# EAGLE design DeMux (EAGLE 6.6.0)

## Sheet 1 of 2
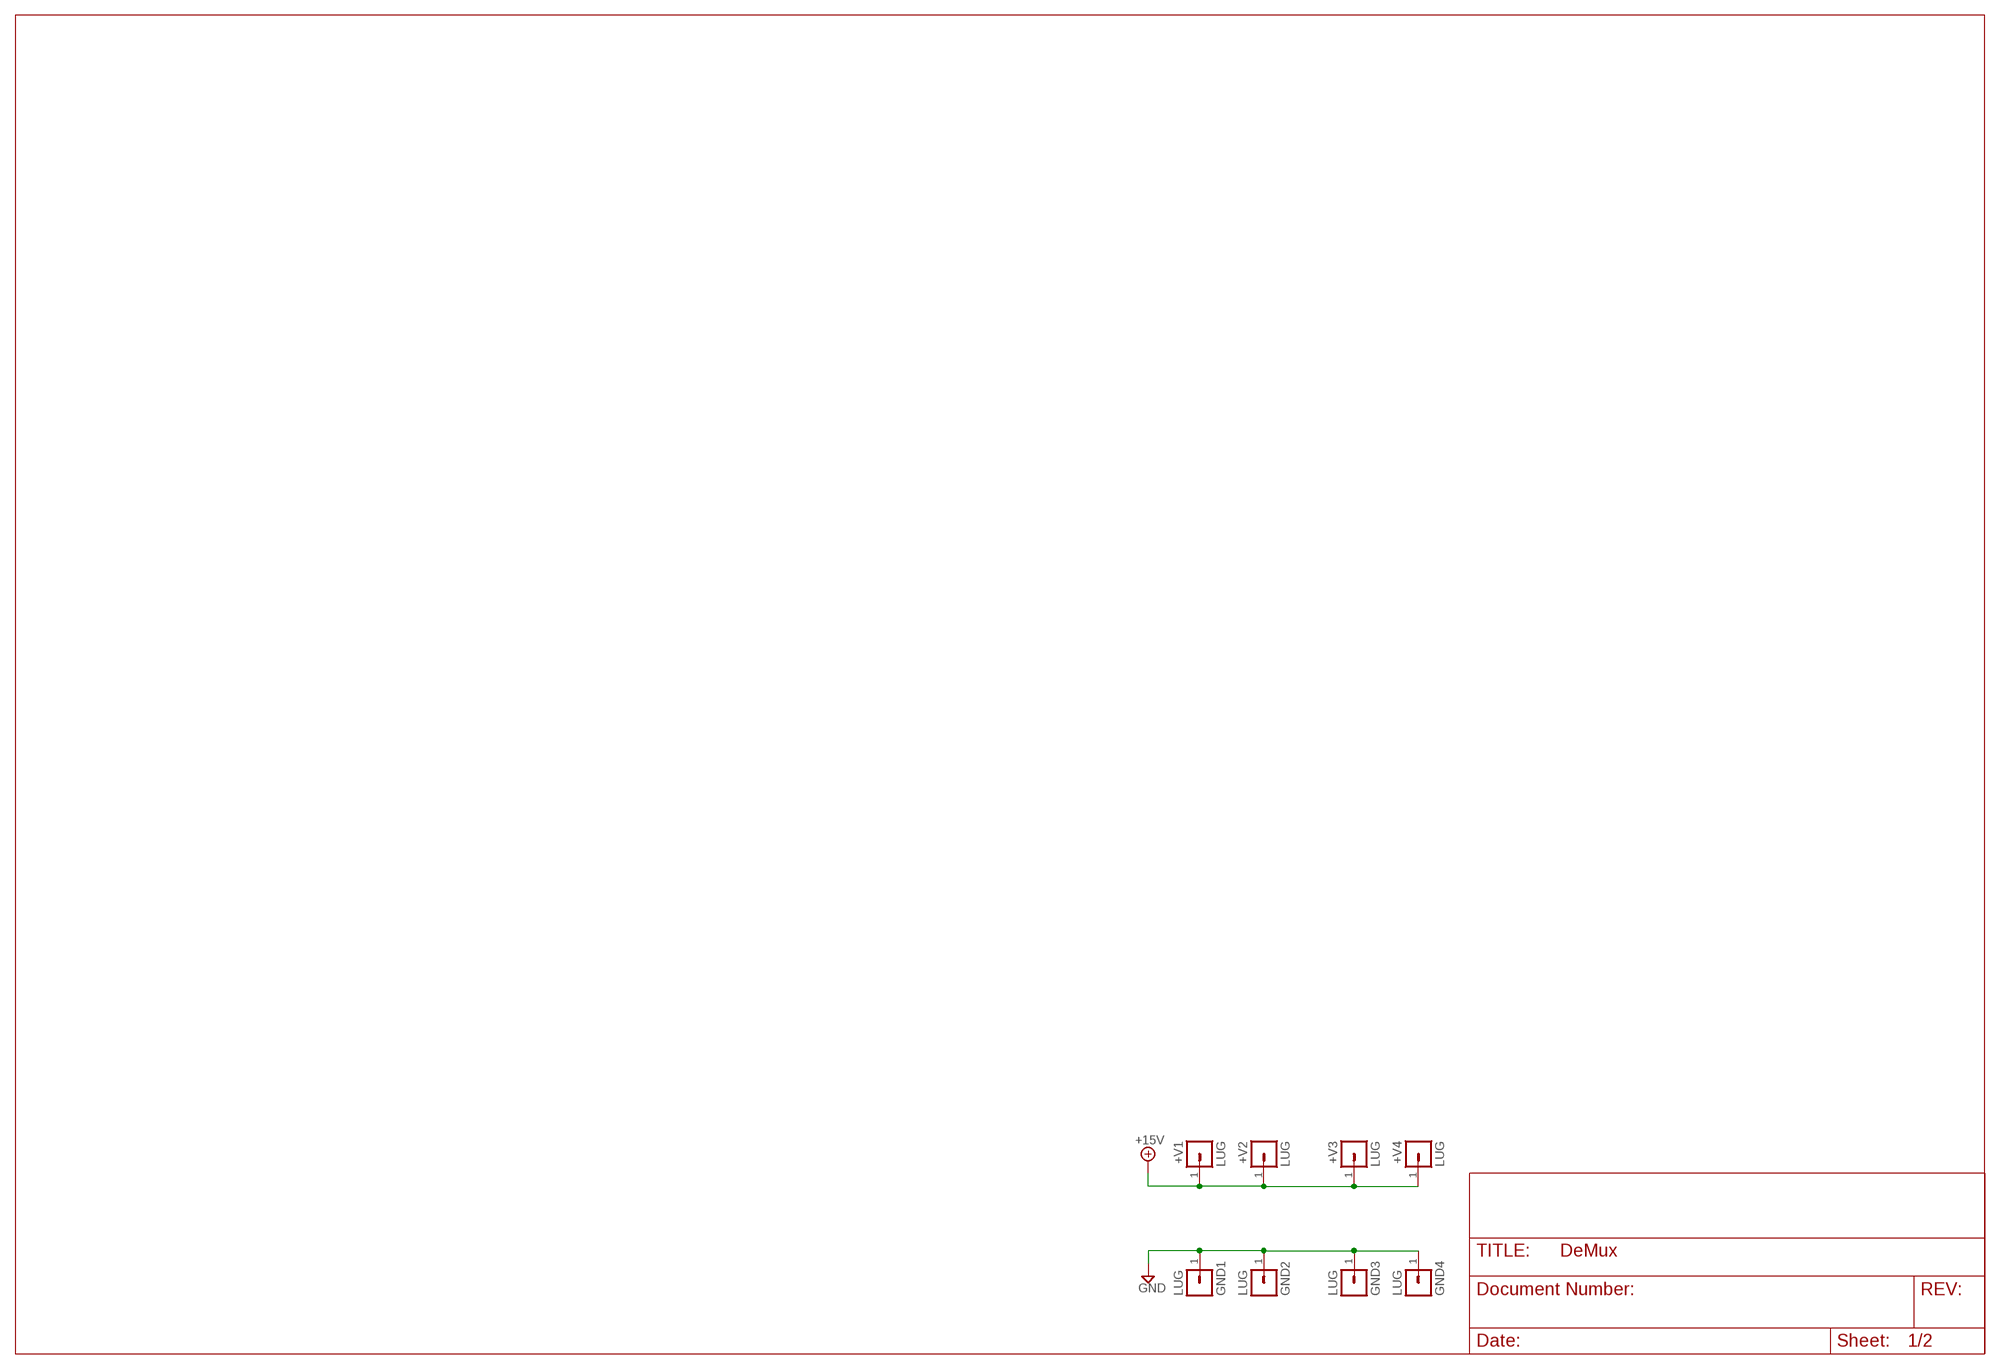
[diagram p0: schematic, sheet 1]

### Parts
+V1  LUG  [SPADELUG]
+V2  LUG  [SPADELUG]
+V3  LUG  [SPADELUG]
+V4  LUG  [SPADELUG]
GND1  LUG  [SPADELUG]
GND2  LUG  [SPADELUG]
GND3  LUG  [SPADELUG]
GND4  LUG  [SPADELUG]

### Nets
+15V [supply]: +V1.1 +V2.1 +V3.1 +V4.1
GND [supply]: GND1.1 GND2.1 GND3.1 GND4.1 ; also sheet 2

## Sheet 2 of 2
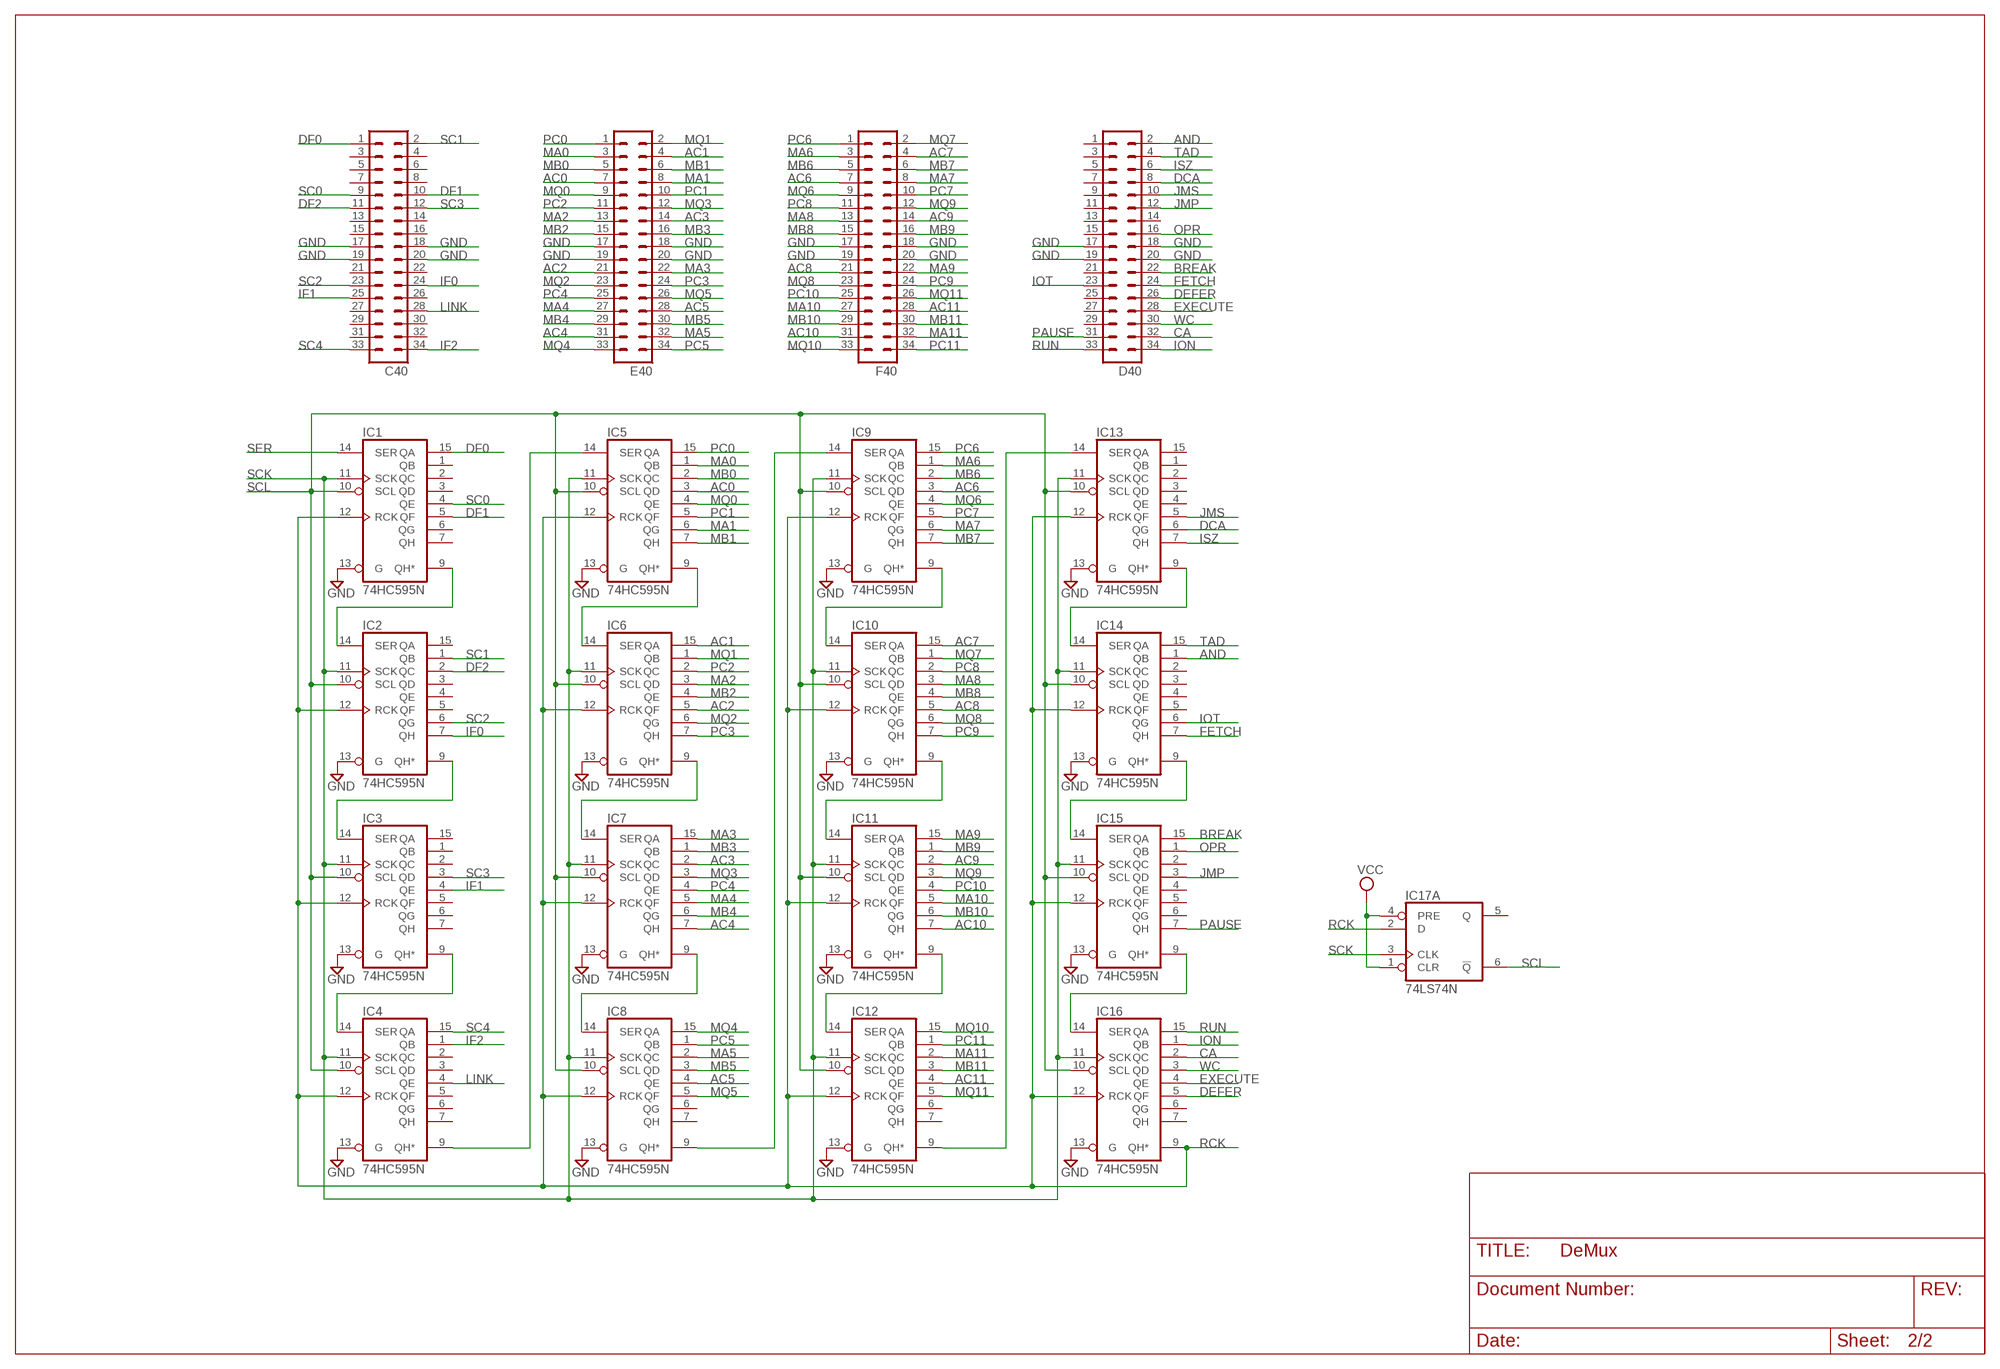
[diagram p1: schematic, sheet 2]

### Parts
C40  MA17-2  [MA17-2]
D40  MA17-2  [MA17-2]
E40  MA17-2  [MA17-2]
F40  MA17-2  [MA17-2]
IC1  74HC595N  74LS595N  [DIL16]
IC2  74HC595N  74LS595N  [DIL16]
IC3  74HC595N  74LS595N  [DIL16]
IC4  74HC595N  74LS595N  [DIL16]
IC5  74HC595N  74LS595N  [DIL16]
IC6  74HC595N  74LS595N  [DIL16]
IC7  74HC595N  74LS595N  [DIL16]
IC8  74HC595N  74LS595N  [DIL16]
IC9  74HC595N  74LS595N  [DIL16]
IC10  74HC595N  74LS595N  [DIL16]
IC11  74HC595N  74LS595N  [DIL16]
IC12  74HC595N  74LS595N  [DIL16]
IC13  74HC595N  74LS595N  [DIL16]
IC14  74HC595N  74LS595N  [DIL16]
IC15  74HC595N  74LS595N  [DIL16]
IC16  74HC595N  74LS595N  [DIL16]
IC17  74LS74N  [DIL14]

### Nets
AC0: E40.7 IC5.3(QD)
AC1: E40.4 IC6.15(QA)
AC2: E40.21 IC6.5(QF)
AC3: E40.14 IC7.2(QC)
AC4: E40.31 IC7.7(QH)
AC5: E40.28 IC8.4(QE)
AC6: F40.7 IC9.3(QD)
AC7: F40.4 IC10.15(QA)
AC8: F40.21 IC10.5(QF)
AC9: F40.14 IC11.2(QC)
AC10: F40.31 IC11.7(QH)
AC11: F40.28 IC12.4(QE)
AND: D40.2 IC14.1(QB)
BREAK: D40.22 IC15.15(QA)
CA: D40.32 IC16.2(QC)
DCA: D40.8 IC13.6(QG)
DEFER: D40.26 IC16.5(QF)
DF0: C40.1 IC1.15(QA)
DF1: C40.10 IC1.5(QF)
DF2: C40.11 IC2.2(QC)
EXECUTE: D40.28 IC16.4(QE)
FETCH: D40.24 IC14.7(QH)
GND [supply]: C40.17 C40.18 C40.19 C40.20 D40.17 D40.18 D40.19 D40.20 E40.17 E40.18 E40.19 E40.20 F40.17 F40.18 F40.19 F40.20 IC1.13(G) IC2.13(G) IC3.13(G) IC4.13(G) IC5.13(G) IC6.13(G) IC7.13(G) IC8.13(G) IC9.13(G) IC10.13(G) IC11.13(G) IC12.13(G) IC13.13(G) IC14.13(G) IC15.13(G) IC16.13(G) ; also sheet 1
IF0: C40.24 IC2.7(QH)
IF1: C40.25 IC3.4(QE)
IF2: C40.34 IC4.1(QB)
ION: D40.34 IC16.1(QB)
IOT: D40.23 IC14.6(QG)
ISZ: D40.6 IC13.7(QH)
JMP: D40.12 IC15.3(QD)
JMS: D40.10 IC13.5(QF)
LINK: C40.28 IC4.4(QE)
MA0: E40.3 IC5.1(QB)
MA1: E40.8 IC5.6(QG)
MA2: E40.13 IC6.3(QD)
MA3: E40.22 IC7.15(QA)
MA4: E40.27 IC7.5(QF)
MA5: E40.32 IC8.2(QC)
MA6: F40.3 IC9.1(QB)
MA7: F40.8 IC9.6(QG)
MA8: F40.13 IC10.3(QD)
MA9: F40.22 IC11.15(QA)
MA10: F40.27 IC11.5(QF)
MA11: F40.32 IC12.2(QC)
MB0: E40.5 IC5.2(QC)
MB1: E40.6 IC5.7(QH)
MB2: E40.15 IC6.4(QE)
MB3: E40.16 IC7.1(QB)
MB4: E40.29 IC7.6(QG)
MB5: E40.30 IC8.3(QD)
MB6: F40.5 IC9.2(QC)
MB7: F40.6 IC9.7(QH)
MB8: F40.15 IC10.4(QE)
MB9: F40.16 IC11.1(QB)
MB10: F40.29 IC11.6(QG)
MB11: F40.30 IC12.3(QD)
MQ0: E40.9 IC5.4(QE)
MQ1: E40.2 IC6.1(QB)
MQ2: E40.23 IC6.6(QG)
MQ3: E40.12 IC7.3(QD)
MQ4: E40.33 IC8.15(QA)
MQ5: E40.26 IC8.5(QF)
MQ6: F40.9 IC9.4(QE)
MQ7: F40.2 IC10.1(QB)
MQ8: F40.23 IC10.6(QG)
MQ9: F40.12 IC11.3(QD)
MQ10: F40.33 IC12.15(QA)
MQ11: F40.26 IC12.5(QF)
N$4: IC5.9(QH*) IC6.14(SER)
N$10: IC1.9(QH*) IC2.14(SER)
N$11: IC2.9(QH*) IC3.14(SER)
N$12: IC3.9(QH*) IC4.14(SER)
N$13: IC7.9(QH*) IC8.14(SER)
N$14: IC6.9(QH*) IC7.14(SER)
N$15: IC11.9(QH*) IC12.14(SER)
N$16: IC10.9(QH*) IC11.14(SER)
N$17: IC14.9(QH*) IC15.14(SER)
N$18: IC15.9(QH*) IC16.14(SER)
N$19: IC9.9(QH*) IC10.14(SER)
N$20: IC13.9(QH*) IC14.14(SER)
N$21: IC4.9(QH*) IC5.14(SER)
N$22: IC8.9(QH*) IC9.14(SER)
N$23: IC12.9(QH*) IC13.14(SER)
OPR: D40.16 IC15.1(QB)
PAUSE: D40.31 IC15.7(QH)
PC0: E40.1 IC5.15(QA)
PC1: E40.10 IC5.5(QF)
PC2: E40.11 IC6.2(QC)
PC3: E40.24 IC6.7(QH)
PC4: E40.25 IC7.4(QE)
PC5: E40.34 IC8.1(QB)
PC6: F40.1 IC9.15(QA)
PC7: F40.10 IC9.5(QF)
PC8: F40.11 IC10.2(QC)
PC9: F40.24 IC10.7(QH)
PC10: F40.25 IC11.4(QE)
PC11: F40.34 IC12.1(QB)
RCK: IC1.12(RCK) IC2.12(RCK) IC3.12(RCK) IC4.12(RCK) IC5.12(RCK) IC6.12(RCK) IC7.12(RCK) IC8.12(RCK) IC9.12(RCK) IC10.12(RCK) IC11.12(RCK) IC12.12(RCK) IC13.12(RCK) IC14.12(RCK) IC15.12(RCK) IC16.9(QH*) IC16.12(RCK) IC17.2(A:D)
RUN: D40.33 IC16.15(QA)
SC0: C40.9 IC1.4(QE)
SC1: C40.2 IC2.1(QB)
SC2: C40.23 IC2.6(QG)
SC3: C40.12 IC3.3(QD)
SC4: C40.33 IC4.15(QA)
SCK: IC1.11(SCK) IC2.11(SCK) IC3.11(SCK) IC4.11(SCK) IC5.11(SCK) IC6.11(SCK) IC7.11(SCK) IC8.11(SCK) IC9.11(SCK) IC10.11(SCK) IC11.11(SCK) IC12.11(SCK) IC13.11(SCK) IC14.11(SCK) IC15.11(SCK) IC16.11(SCK) IC17.3(A:CLK)
SCL: IC1.10(SCL) IC2.10(SCL) IC3.10(SCL) IC4.10(SCL) IC5.10(SCL) IC6.10(SCL) IC7.10(SCL) IC8.10(SCL) IC9.10(SCL) IC10.10(SCL) IC11.10(SCL) IC12.10(SCL) IC13.10(SCL) IC14.10(SCL) IC15.10(SCL) IC16.10(SCL) IC17.6(A:!Q)
SER: IC1.14(SER)
TAD: D40.4 IC14.15(QA)
VCC [supply]: IC17.1(A:CLR) IC17.4(A:PRE)
WC: D40.30 IC16.3(QD)
Unconnected: C40.3 C40.4 C40.5 C40.6 C40.7 C40.8 C40.13 C40.14 C40.15 C40.16 C40.21 C40.22 C40.26 C40.27 C40.29 C40.30 C40.31 C40.32 D40.1 D40.3 D40.5 D40.7 D40.9 D40.11 D40.13 D40.14 D40.15 D40.21 D40.25 D40.27 D40.29 IC1.1(QB) IC1.2(QC) IC1.3(QD) IC1.6(QG) IC1.7(QH) IC2.3(QD) IC2.4(QE) IC2.5(QF) IC2.15(QA) IC3.1(QB) IC3.2(QC) IC3.5(QF) IC3.6(QG) IC3.7(QH) IC3.15(QA) IC4.2(QC) IC4.3(QD) IC4.5(QF) IC4.6(QG) IC4.7(QH) IC8.6(QG) IC8.7(QH) IC12.6(QG) IC12.7(QH) IC13.1(QB) IC13.2(QC) IC13.3(QD) IC13.4(QE) IC13.15(QA) IC14.2(QC) IC14.3(QD) IC14.4(QE) IC14.5(QF) IC15.2(QC) IC15.4(QE) IC15.5(QF) IC15.6(QG) IC16.6(QG) IC16.7(QH) IC17.5(A:Q) IC17.8(B:!Q) IC17.9(B:Q) IC17.10(B:PRE) IC17.11(B:CLK) IC17.12(B:D) IC17.13(B:CLR)

## Power pins joined to a net without a drawn wire
GND: IC1.8(GND) IC2.8(GND) IC3.8(GND) IC4.8(GND) IC5.8(GND) IC6.8(GND) IC7.8(GND) IC8.8(GND) IC9.8(GND) IC10.8(GND) IC11.8(GND) IC12.8(GND) IC13.8(GND) IC14.8(GND) IC15.8(GND) IC16.8(GND) IC17.7(P:GND)
VCC: IC1.16(VCC) IC2.16(VCC) IC3.16(VCC) IC4.16(VCC) IC5.16(VCC) IC6.16(VCC) IC7.16(VCC) IC8.16(VCC) IC9.16(VCC) IC10.16(VCC) IC11.16(VCC) IC12.16(VCC) IC13.16(VCC) IC14.16(VCC) IC15.16(VCC) IC16.16(VCC) IC17.14(P:VCC)

## Library data of the parts
+V1-+V4 GND1-GND4 = dec-con:LUG: Spade Lug
C40 D40 E40 F40 = con-lstb:MA17-2: PIN HEADER; OC_FARNELL: unknown; OC_NEWARK: unknown
IC1-IC16 = 74xx-us:74*595: 8-bit SHIFT REGISTER, output latch
IC17 = 74xx-us:74*74: Dual D type positive edge triggered FLIP FLOP, preset and clear

## Net classes
1 supply: width 0.762 mm

## Board
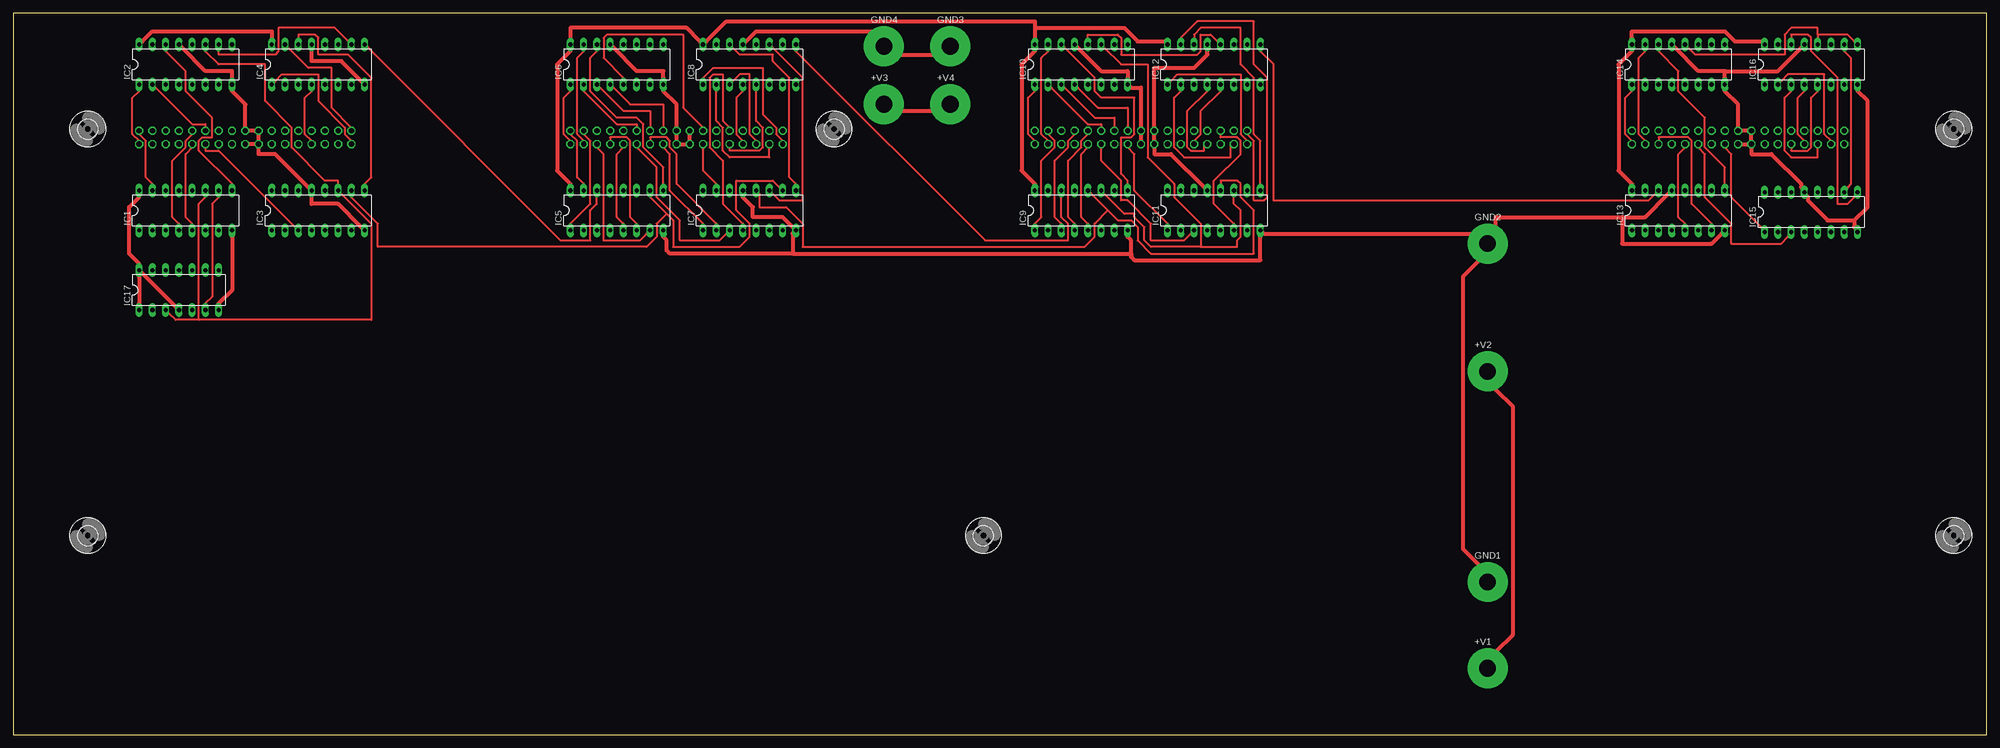
[diagram p2: board, top side]
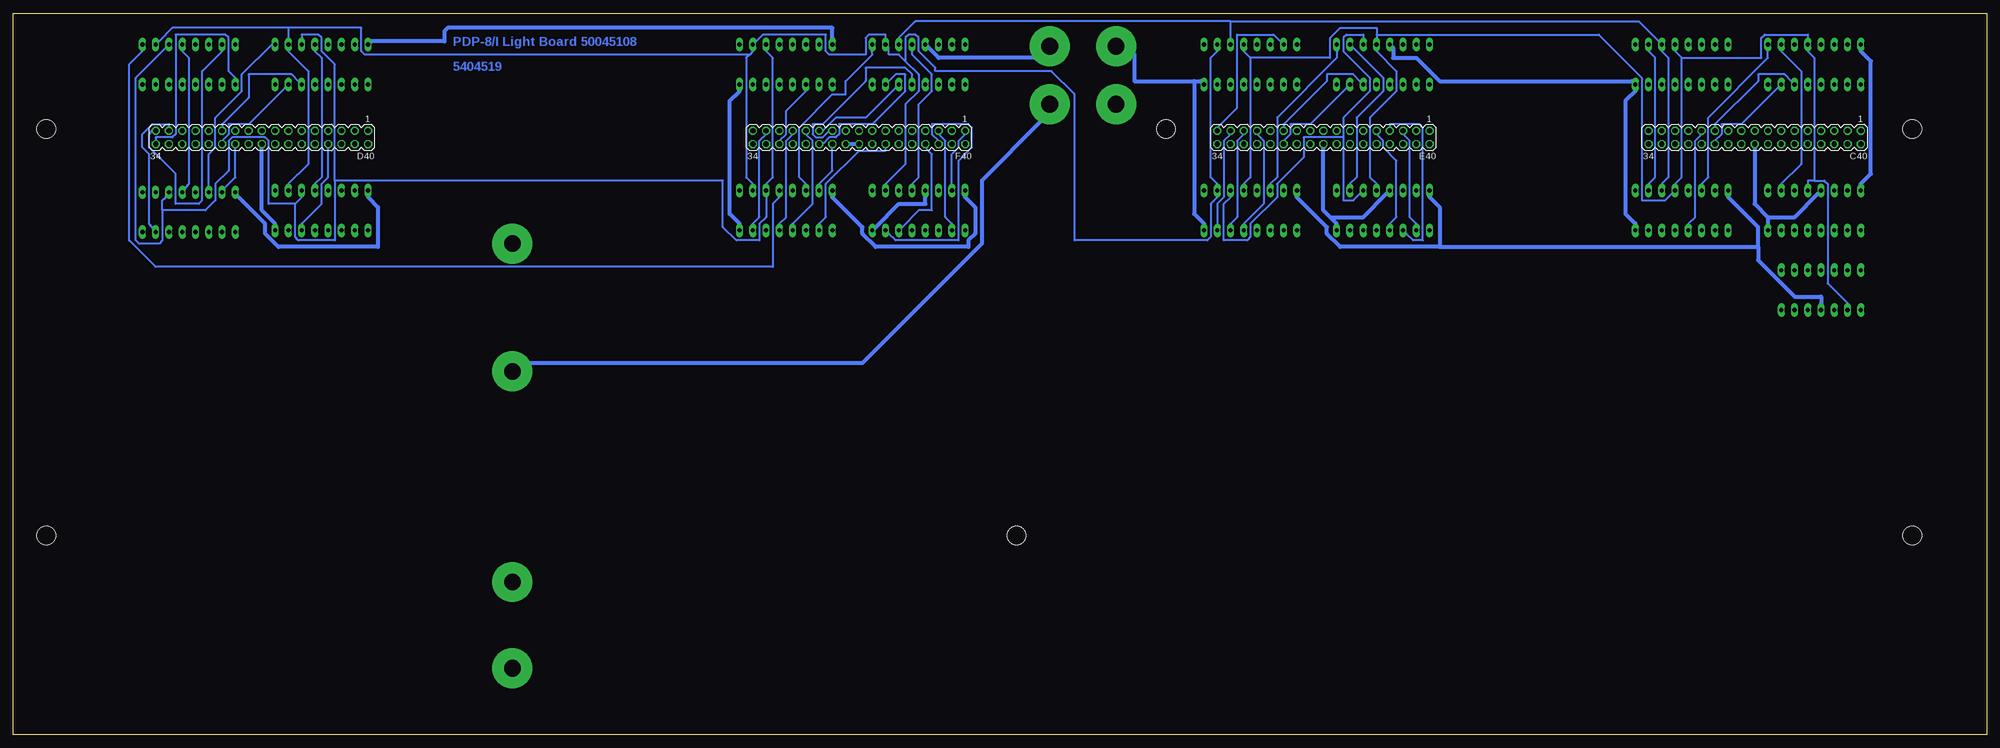
[diagram p3: board, bottom side, seen from below]

Size 377.82 x 138.11 mm. Coordinates in mm from the lower left corner, seen from the top.
Outline: 377.82,138.11 377.82,0 174.62,0 0,0 0,138.11 173.04,138.11
Outline: 377.82,138.11 173.04,138.11
Outline: 377.82,138.11 173.04,138.11
Copper layers (1*16): Top 0.035mm / dielectric 1.5mm / Bottom 0.035mm
Design rules "15mils": minimum track width 15mil, minimum drill 24mil, track to track 15mil, track to pad 10mil, pad to pad 10mil, via to via 10mil, smd to smd 10mil, copper to edge 25mil, drill to drill 10mil, minimum pad ring 10mil, minimum via ring 8mil, stop-mask expansion 0mil, vias tented up to drill 0mil, thermal gap 10mil

### Footprints (pad centres in the part's own frame; a part is rotated, then mirrored left to right if it is on the bottom)
SPADELUG = drill 3.175 pad 7.62: 1 0,0
MA17-2 = drill 1.016 octagon: 1 -20.32,-1.27; 2 -20.32,1.27; 3 -17.78,-1.27; 4 -17.78,1.27; 5 -15.24,-1.27; 6 -15.24,1.27; 7 -12.7,-1.27; 8 -12.7,1.27; 9 -10.16,-1.27; 10 -10.16,1.27; 11 -7.62,-1.27; 12 -7.62,1.27; 13 -5.08,-1.27; 14 -5.08,1.27; 15 -2.54,-1.27; 16 -2.54,1.27; 17 0,-1.27; 18 0,1.27; 19 2.54,-1.27; 20 2.54,1.27; 21 5.08,-1.27; 22 5.08,1.27; 23 7.62,-1.27; 24 7.62,1.27; 25 10.16,-1.27; 26 10.16,1.27; 27 12.7,-1.27; 28 12.7,1.27; 29 15.24,-1.27; 30 15.24,1.27; 31 17.78,-1.27; 32 17.78,1.27; 33 20.32,-1.27; 34 20.32,1.27
DIL16 = drill 0.813 long: 1 -8.89,-3.81; 2 -6.35,-3.81; 3 -3.81,-3.81; 4 -1.27,-3.81; 5 1.27,-3.81; 6 3.81,-3.81; 7 6.35,-3.81; 8 8.89,-3.81; 9 8.89,3.81; 10 6.35,3.81; 11 3.81,3.81; 12 1.27,3.81; 13 -1.27,3.81; 14 -3.81,3.81; 15 -6.35,3.81; 16 -8.89,3.81
DIL14 = drill 0.813 long: 1 -7.62,-3.81; 2 -5.08,-3.81; 3 -2.54,-3.81; 4 0,-3.81; 5 2.54,-3.81; 6 5.08,-3.81; 7 7.62,-3.81; 8 7.62,3.81; 9 5.08,3.81; 10 2.54,3.81; 11 0,3.81; 12 -2.54,3.81; 13 -5.08,3.81; 14 -7.62,3.81
3,6 = hole 3.6: 0,0

### Placement (x,y rotation side)
+V1  282.26,12.7 0 top
+V2  282.26,69.53 0 top
+V3  166.69,120.65 0 top
+V4  179.39,120.65 0 top
C40  44.45,114.3 180 bottom
D40  330.2,114.3 180 bottom
E40  127,114.3 180 bottom
F40  215.9,114.3 180 bottom
GND1  282.26,29.21 0 top
GND2  282.26,93.98 0 top
GND3  179.39,131.76 0 top
GND4  166.69,131.76 0 top
IC1  33.02,100.33 0 top
IC2  33.02,128.27 0 top
IC3  58.42,100.33 0 top
IC4  58.42,128.27 0 top
IC5  115.57,100.33 0 top
IC6  115.57,128.27 0 top
IC7  140.97,100.33 0 top
IC8  140.97,128.27 0 top
IC9  204.47,100.33 0 top
IC10  204.47,128.27 0 top
IC11  229.87,100.33 0 top
IC12  229.87,128.27 0 top
IC13  318.77,100.33 0 top
IC14  318.77,128.27 0 top
IC15  344.17,100.01 0 top
IC16  344.17,128.27 0 top
IC17  31.75,85.09 0 top
U$5  [3,6]  371.48,115.89 0 top
U$6  [3,6]  371.48,38.1 0 top
U$7  [3,6]  185.74,38.1 0 top
U$8  [3,6]  14.29,38.1 0 top
U$9  [3,6]  14.29,115.89 0 top
U$11  [3,6]  157.16,115.89 0 top

### Tracks (layer width: path | path; a pad name or v marks a point on that pad's centre or on a via)
+15V
  Top 0.762: +V3.1 170.18,119.38 175.9,119.38 +V4.1 | +V1.1 283.85,15.88 287.02,19.05 287.02,62.87 283.85,66.04 +V2.1
  Bottom 0.762: +V4.1 180.97,117.47 192.41,106.05 192.41,93.98 215.26,71.12 278.76,71.12 +V2.1
AC0
  Bottom 0.381: IC5.3 111.12,95.89 109.86,94.61 107.95,94.61 107.95,116.2 108.58,116.84 114.3,116.84 114.3,116.2 E40.7
AC1
  Top 0.381: IC6.15 109.22,130.81 107.95,129.54 107.95,114.94 109.22,113.67 E40.4
AC2
  Top 0.381: IC6.5 116.84,125.73 113.03,129.54 113.03,133.35 113.67,133.99 128.27,133.99 128.27,120.02 132.08,116.2 E40.21
AC3
  Top 0.381: IC7.2 134.62,97.79 127,105.41 127,111.12 125.73,112.39 125.73,113.67 125.09,114.3 121.92,114.3 121.92,113.67 E40.14
AC4
  Bottom 0.381: IC7.7 147.32,97.79 147.32,101.6 146.05,102.87 146.05,113.67 144.78,114.94 E40.31
AC5
  Top 0.381: IC8.4 139.7,123.19 138.43,121.92 138.43,114.94 139.7,113.67 E40.28
AC6
  Top 0.381: IC9.3 200.66,97.79 199.39,99.06 199.39,109.86 201.93,112.39 201.93,113.67 203.2,114.94 F40.7
AC7
  Top 0.381: IC10.15 198.12,130.81 196.85,129.54 196.85,114.94 198.12,113.67 F40.4
AC8
  Bottom 0.381: IC10.5 205.74,125.73 205.74,126.36 207.01,127.64 214.63,127.64 214.63,125.09 222.88,116.84 224.79,116.84 224.79,114.94 224.16,114.3 222.88,114.3 221.62,115.57 F40.21
AC9
  Bottom 0.381: IC11.2 223.52,97.79 222.25,99.06 222.25,105.41 215.9,111.76 210.82,111.76 210.82,112.39 F40.14
AC10
  Bottom 0.381: IC11.7 236.22,97.79 234.95,99.06 234.95,113.67 233.68,114.94 F40.31
AC11
  Top 0.381: IC12.4 228.6,123.19 224.79,119.38 224.79,112.39 225.43,111.76 227.97,111.76 227.97,113.03 F40.28
AND
  Top 0.381: IC14.1 309.88,123.19 308.61,121.92 308.61,114.94 309.88,113.67 D40.2
BREAK
  Bottom 0.381: IC15.15 337.19,104.78 335.28,106.68 335.28,112.39 D40.22
CA
  Top 0.381: IC16.2 338.45,125.09 339.73,126.36 346.71,126.36 346.71,114.94 347.98,113.67 D40.32
DCA
  Bottom 0.381: IC13.6 322.58,97.79 318.77,101.6 318.77,105.41 317.5,106.68 317.5,112.39 D40.8
DEFER
  Top 0.381: IC16.5 345.44,123.19 344.17,121.92 344.17,112.39 343.54,111.76 340.36,111.76 340.36,112.39 D40.26
DF0
  Top 0.381: IC1.15 26.67,105.41 25.4,106.68 25.4,113.67 24.13,114.94 C40.1
DF1
  Top 0.381: IC1.5 34.29,97.79 33.02,99.06 33.02,111.12 34.29,112.39 C40.10
DF2
  Top 0.381: IC2.2 27.3,123.83 34.29,116.84 36.83,116.84 36.83,116.2 C40.11
EXECUTE
  Top 0.381: IC16.4 342.9,123.19 341.63,121.92 341.63,114.94 342.9,113.67 D40.28
FETCH
  Bottom 0.381: IC14.7 325.75,123.83 332.74,116.84 336.55,116.84 336.55,114.94 337.82,113.67 D40.24
GND
  Top 0.762: IC17.7 39.37,82.55 41.91,85.09 41.91,95.25 IC1.8 | IC4.8 66.67,125.09 62.87,128.91 57.15,128.91 57.15,130.81 IC4.13 | IC3.8 66.67,97.16 62.23,101.6 57.15,101.6 57.15,102.87 IC3.13 56.52,104.78 50.16,111.12 46.99,111.12 46.99,112.39 C40.20 | C40.18 45.09,113.03 46.35,113.03 C40.20 | C40.20 46.99,113.67 46.99,114.94 C40.19 46.35,115.57 45.09,115.57 C40.17 44.45,116.2 44.45,120.65 41.91,123.19 IC2.8 41.91,125.73 41.91,127 36.83,127 32.38,131.44 IC2.13 | IC12.13 228.6,130.81 228.6,130.18 226.06,127.64 218.44,127.64 218.44,116.2 F40.19 218.44,114.94 218.44,113.67 F40.20 218.44,112.39 218.44,111.12 221.62,111.12 227.97,104.78 IC11.13 | IC10.13 203.84,131.44 208.28,127 213.36,127 213.36,125.73 IC10.8 214,123.83 215.9,123.83 215.9,116.2 F40.17 215.9,114.94 215.9,113.67 F40.18 | IC6.13 114.94,131.44 119.38,127 124.46,127 124.46,125.73 IC6.8 124.46,123.19 127,120.65 127,116.2 E40.17 127,114.94 127,113.67 E40.18 127.64,113.03 128.91,113.03 E40.20 129.54,113.67 129.54,114.94 E40.19 | IC7.13 139.7,102.87 141.6,100.97 141.6,99.06 147.32,99.06 149.22,97.16 IC7.8 149.22,95.89 149.22,92.08 | IC8.13 140.34,132.72 142.24,134.62 164.47,134.62 GND4.1 170.18,130.18 175.9,130.18 GND3.1 | 149.22,92.08 125.73,92.08 125.09,92.71 125.09,94.61 124.46,95.25 IC5.8 | 352.43,98.42 347.35,98.42 343.54,102.23 343.54,102.87 IC15.13 342.26,104.78 342.26,105.41 336.55,111.12 332.74,111.12 332.74,112.39 D40.20 | 352.43,98.42 352.43,97.16 IC15.8 | 352.43,98.42 354.96,100.97 354.96,121.28 353.06,123.19 IC16.8 | D40.20 332.11,113.03 330.83,113.03 D40.18 | D40.20 332.74,113.67 332.74,114.94 D40.19 332.11,115.57 330.83,115.57 D40.17 330.2,116.2 330.2,120.65 327.66,123.19 IC14.8 327.66,125.73 327.66,127
  Top 0.762: 327.66,127 322.58,127 318.13,131.44 IC14.13 | 327.66,127 337.82,127 342.26,131.44 IC16.13 | 214,92.08 214,91.44 214.63,90.81 238.76,90.81 238.76,95.25 IC11.8 239.4,95.89 279.4,95.89 GND2.1 | 214,92.08 214,94.61 213.36,95.25 IC9.8 | 307.98,99.06 283.85,99.06 283.85,97.16 GND2.1 | 307.98,99.06 312.42,99.06 316.87,103.5 IC13.13 | GND1.1 280.67,32.38 277.5,35.56 277.5,87.63 280.67,90.81 GND2.1 | 307.98,99.06 307.98,93.98 325.12,93.98 327.02,95.89 IC13.8 | 149.22,92.08 214,92.08
  Bottom 0.762: 41.91,99.06 36.83,99.06 32.38,103.5 IC1.13 | 41.91,99.06 41.91,97.79 IC1.8 | IC3.8 67.31,97.79 69.22,99.69 69.22,121.28 67.31,123.19 IC4.8 67.94,125.09 104.78,125.09 109.22,129.54 113.67,129.54 113.67,131.44 IC6.13 | 41.91,99.06 44.45,101.6 44.45,112.39 C40.18 | F40.18 216.53,113.03 217.81,113.03 F40.20 | 125.73,99.06 127,100.33 127,112.39 E40.18 | 125.73,99.06 124.46,97.79 IC5.8 | 125.73,99.06 119.38,99.06 114.94,103.5 IC5.13 | 151.76,125.09 163.19,125.09 163.19,130.18 GND4.1 | 151.76,125.09 150.5,125.09 IC8.8 | 151.76,125.09 151.76,99.69 149.86,97.79 IC7.8 | IC10.13 202.56,131.44 200.66,129.54 182.25,129.54 GND3.1 | IC13.8 327.66,97.79 330.2,100.33 330.2,112.39 D40.18 | IC9.8 212.72,97.16 208.28,101.6 203.2,101.6 203.2,102.87 IC9.13 | IC11.8 238.76,97.79 240.66,99.69 240.66,121.28 238.76,123.19 IC12.8
IF0
  Bottom 0.381: IC2.7 40.01,123.83 46.99,116.84 50.8,116.84 50.8,114.94 52.07,113.67 C40.24
IF1
  Bottom 0.381: IC3.4 57.15,97.79 55.88,99.06 55.88,113.67 54.61,114.94 C40.25
IF2
  Top 0.381: IC4.1 50.16,125.09 51.44,126.36 58.42,126.36 58.42,121.28 63.5,116.2 63.5,114.94 64.77,113.67 C40.34
ION
  Bottom 0.381: IC16.1 335.28,125.73 336.55,127 336.55,133.35 337.19,133.99 346.71,133.99 346.71,114.94 347.35,114.3 350.52,114.3 350.52,113.67 D40.34
IOT
  Bottom 0.381: IC14.6 323.21,125.09 324.49,126.36 332.74,126.36 332.74,121.92 337.82,116.84 337.82,116.2 D40.23
ISZ
  Top 0.381: IC13.7 325.12,97.79 321.31,101.6 321.31,113.67 320.68,114.3 314.96,114.3 314.96,113.67 D40.6
JMP
  Top 0.381: IC15.3 339.73,95.25 338.45,93.98 328.93,93.98 328.93,97.79 323.85,102.87 323.85,111.12 322.58,112.39 D40.12
JMS
  Top 0.381: IC13.5 320.04,97.79 318.77,99.06 318.77,111.12 320.04,112.39 D40.10
LINK
  Top 0.381: IC4.4 57.15,123.19 55.88,121.92 55.88,114.94 57.15,113.67 C40.28
MA0
  Top 0.381: IC5.1 106.68,97.79 110.49,101.6 110.49,113.67 109.22,114.94 E40.3
MA1
  Top 0.381: IC5.6 119.38,97.79 118.11,99.06 118.11,113.67 117.47,114.3 114.3,114.3 114.3,113.67 E40.8
MA2
  Top 0.381: IC6.3 112.39,123.83 116.84,119.38 121.92,119.38 121.92,116.2 E40.13
MA3
  Top 0.381: IC7.15 134.62,105.41 132.08,107.95 132.08,112.39 E40.22
MA4
  Bottom 0.381: IC7.5 142.24,97.79 138.43,101.6 138.43,113.67 139.7,114.94 E40.27
MA5
  Top 0.381: IC8.2 134.62,123.19 134.62,117.47 135.89,116.2 135.89,111.76 137.16,110.49 144.78,110.49 144.78,112.39 E40.32
MA6
  Top 0.381: IC9.1 195.58,97.79 196.85,99.06 196.85,109.86 199.39,112.39 199.39,113.67 198.12,114.94 F40.3
MA7
  Bottom 0.381: IC9.6 207.65,97.16 204.47,100.33 201.93,100.33 201.93,111.12 203.2,112.39 F40.8
MA8
  Top 0.381: IC10.3 201.29,123.83 207.01,118.11 210.82,118.11 210.82,116.2 F40.13
MA9
  Bottom 0.381: IC11.15 223.52,105.41 220.98,107.95 220.98,112.39 F40.22
MA10
  Bottom 0.381: IC11.5 231.14,97.79 229.87,99.06 229.87,113.67 228.6,114.94 F40.27
MA11
  Top 0.381: IC12.2 223.52,123.19 222.25,121.92 222.25,112.39 224.16,110.49 233.04,110.49 233.04,113.03 F40.32
MB0
  Bottom 0.381: IC5.2 109.22,97.79 110.49,99.06 110.49,113.67 111.76,114.94 E40.5
MB1
  Top 0.381: IC5.7 121.28,95.89 120.02,94.61 113.03,94.61 113.03,111.12 111.76,112.39 E40.6
MB2
  Top 0.381: IC6.4 114.94,123.83 118.11,120.65 124.46,120.65 124.46,116.2 E40.15
MB3
  Top 0.381: IC7.1 132.08,97.79 125.73,104.14 125.73,111.12 124.46,112.39 E40.16
MB4
  Bottom 0.381: IC7.6 144.78,97.79 143.51,99.06 143.51,113.67 142.24,114.94 E40.29
MB5
  Top 0.381: IC8.3 137.79,125.09 139.06,126.36 140.97,126.36 140.97,114.94 142.24,113.67 E40.30
MB6
  Bottom 0.381: IC9.2 198.12,97.79 199.39,99.06 199.39,113.67 200.66,114.94 F40.5
MB7
  Bottom 0.381: IC9.7 210.19,95.89 208.91,94.61 196.85,94.61 196.85,109.86 194.31,112.39 194.31,116.2 194.94,116.84 201.93,116.84 201.93,114.94 200.66,113.67 F40.6
MB8
  Top 0.381: IC10.4 203.84,123.83 207.65,120.02 213.36,120.02 213.36,116.2 F40.15
MB9
  Top 0.381: IC11.1 220.98,97.79 214.63,104.14 214.63,111.12 213.36,112.39 F40.16
MB10
  Top 0.381: IC11.6 233.68,97.79 229.87,101.6 229.87,106.05 234.95,111.12 234.95,113.67 234.31,114.3 231.14,114.3 231.14,114.94 F40.29
MB11
  Bottom 0.381: IC12.3 226.06,123.19 229.87,119.38 229.87,114.94 231.14,113.67 F40.30
MQ0
  Bottom 0.381: IC5.4 114.3,97.79 113.03,99.06 113.03,109.86 115.57,112.39 115.57,113.67 116.84,114.94 E40.9
MQ1
  Top 0.381: IC6.1 106.68,123.19 105.41,121.92 105.41,114.94 106.68,113.67 E40.2
MQ2
  Bottom 0.381: IC6.6 120.02,125.09 121.28,126.36 126.36,126.36 126.36,125.09 134.62,116.84 134.62,116.2 E40.23
MQ3
  Top 0.381: IC7.3 136.53,95.89 135.25,94.61 127.64,94.61 127.64,98.42 123.19,102.87 123.19,108.58 119.38,112.39 E40.12
MQ4
  Bottom 0.381: IC8.15 135.25,132.72 136.53,133.99 143.51,133.99 143.51,120.02 147.32,116.2 E40.33
MQ5
  Top 0.381: IC8.5 142.24,123.19 142.24,117.47 143.51,116.2 143.51,112.39 142.88,111.76 137.16,111.76 137.16,112.39 E40.26
MQ6
  Top 0.381: IC9.4 203.2,97.79 201.93,99.06 201.93,109.86 204.47,112.39 204.47,113.67 205.74,114.94 F40.9
MQ7
  Top 0.381: IC10.1 195.58,123.19 194.31,121.92 194.31,114.94 195.58,113.67 F40.2
MQ8
  Bottom 0.381: IC10.6 208.91,123.83 214.63,118.11 220.34,118.11 222.88,115.57 F40.23
MQ9
  Top 0.381: IC11.3 225.43,95.89 224.16,94.61 217.81,94.61 217.81,97.79 213.36,102.23 212.09,102.23 212.09,106.05 208.28,109.86 208.28,112.39 F40.12
MQ10
  Top 0.381: IC12.15 223.52,133.35 226.69,136.53 237.49,136.53 237.49,128.27 240.03,125.73 240.03,102.87 239.4,102.23 237.49,102.23 237.49,113.67 236.22,114.94 F40.33
MQ11
  Top 0.381: IC12.5 231.14,123.19 227.33,119.38 227.33,114.94 226.06,113.67 F40.26
N$4
  Top 0.381: IC5.9 124.46,105.41 124.46,108.58 120.65,112.39 120.65,116.84 119.38,118.11 115.57,118.11 110.49,123.19 110.49,129.54 111.76,130.81 IC6.14
N$10
  Top 0.381: IC1.9 41.91,105.41 35.56,111.76 35.56,113.67 36.2,114.3 38.1,114.3 38.1,118.11 33.02,123.19 33.02,127 29.21,130.81 IC2.14
N$11
  Bottom 0.381: IC3.14 54.61,105.41 53.34,106.68 53.34,118.11 41.91,129.54 41.91,130.81 IC2.9
N$12
  Top 0.381: IC3.9 67.31,105.41 68.58,106.68 68.58,125.73 64.14,130.18 58.42,130.18 58.42,133.35 57.78,133.99 54.61,133.99 54.61,133.35 IC4.14
N$13
  Top 0.381: IC8.14 137.79,131.44 139.06,130.18 145.41,130.18 145.41,128.91 148.59,125.73 148.59,106.68 149.86,105.41 IC7.9
N$14
  Bottom 0.381: IC7.14 137.16,105.41 135.89,106.68 135.89,118.11 124.46,129.54 124.46,130.81 IC6.9
N$15
  Top 0.381: IC12.14 226.06,133.35 226.06,133.99 227.33,135.25 234.95,135.25 234.95,128.27 237.49,125.73 237.49,114.94 238.76,113.67 238.76,105.41 IC11.9
N$16
  Bottom 0.381: IC11.14 226.06,105.41 227.33,106.68 227.33,116.2 220.98,122.56 218.44,122.56 218.44,125.09 213.36,130.18 213.36,130.81 IC10.9
N$17
  Bottom 0.381: IC15.14 340.36,104.78 340.36,111.12 339.09,112.39 339.09,118.11 334.01,123.19 334.01,126.36 328.3,132.08 IC14.9
N$18
  Top 0.381: IC15.9 352.43,102.87 351.15,101.6 349.25,101.6 349.25,125.73 344.17,130.81 344.17,133.35 343.54,133.99 340.36,133.99 340.36,133.35 IC16.14
N$19
  Top 0.381: IC10.14 201.29,131.44 207.01,125.73 207.01,123.19 208.28,121.92 214.63,121.92 214.63,114.94 214,114.3 212.09,114.3 212.09,107.31 213.36,106.05 213.36,105.41 IC9.9
N$20
  Top 0.381: IC13.9 327.66,105.41 327.66,108.58 323.85,112.39 323.85,118.11 318.77,123.19 318.77,127 314.96,130.81 IC14.14
N$21
  Top 0.381: IC4.9 67.94,131.44 104.78,94.61 110.49,94.61 110.49,100.33 111.76,101.6 111.76,102.87 IC5.14
N$22
  Top 0.381: IC8.9 149.86,130.81 186.06,94.61 201.93,94.61 201.93,97.79 200.66,99.06 200.66,102.87 IC9.14
N$23
  Top 0.381: IC13.14 314.32,103.5 313.06,102.23 241.3,102.23 241.3,128.27 238.76,130.81 IC12.9
OPR
  Top 0.381: IC15.1 334.64,97.16 328.93,102.87 328.93,111.12 327.66,112.39 D40.16
PAUSE
  Bottom 0.381: IC15.7 351.15,97.16 351.79,97.79 351.79,111.12 353.06,112.39 353.06,114.94 351.15,116.84 347.98,116.84 347.98,116.2 D40.31
PC0
  Top 0.381: IC5.15 109.22,105.41 107.95,106.68 107.95,113.67 106.68,114.94 E40.1
PC1
  Top 0.381: IC5.5 116.84,97.79 115.57,99.06 115.57,111.12 116.84,112.39 E40.10
PC2
  Top 0.381: IC6.2 109.22,123.19 115.57,116.84 119.38,116.84 119.38,116.2 E40.11
PC3
  Bottom 0.381: IC6.7 122.56,123.83 129.54,116.84 133.35,116.84 133.35,114.94 134.62,113.67 E40.24
PC4
  Top 0.381: IC7.4 139.7,97.79 135.89,101.6 135.89,109.86 133.35,112.39 133.35,125.73 133.99,126.36 135.89,126.36 135.89,117.47 137.16,116.2 E40.25
PC5
  Top 0.381: IC8.1 132.08,125.73 133.99,127.64 143.51,127.64 143.51,118.75 146.05,116.2 146.05,114.94 147.32,113.67 E40.34
PC6
  Bottom 0.381: IC9.15 198.12,105.41 198.12,111.12 196.85,112.39 196.85,113.67 195.58,114.94 F40.1
PC7
  Top 0.381: IC9.5 205.74,97.79 204.47,99.06 204.47,111.12 205.74,112.39 F40.10
PC8
  Top 0.381: IC10.2 198.75,123.83 205.74,116.84 208.28,116.84 208.28,116.2 F40.11
PC9
  Bottom 0.381: IC10.7 210.19,125.09 208.91,126.36 207.01,126.36 207.01,123.19 213.36,116.84 219.71,116.84 219.71,114.94 220.34,114.3 221.62,114.3 222.88,113.03 F40.24
PC10
  Bottom 0.381: IC11.4 228.6,97.79 224.79,101.6 224.79,113.67 226.06,114.94 F40.25
PC11
  Top 0.381: IC12.1 221.62,125.09 222.88,126.36 234.95,126.36 234.95,114.94 236.22,113.67 F40.34
RCK
  Top 0.381: 345.44,133.99 351.15,133.99 352.43,132.72 IC16.9 | 345.44,133.99 345.44,133.35 IC16.12 | 345.44,133.99 345.44,135.25 340.36,135.25 339.09,133.99 339.09,130.18 321.94,130.18 320.68,131.44 IC14.12 | IC12.12 230.5,132.72 229.24,133.99 227.33,133.99 227.33,130.81 226.69,130.18 212.09,130.18 212.09,133.35 211.46,133.99 205.74,133.99 205.74,133.35 IC10.12 | 209.55,100.33 211.46,98.42 214,98.42 215.26,97.16 215.26,94.61 217.81,92.08 237.49,92.08 237.49,100.33 234.95,102.87 234.95,105.41 234.31,106.05 231.14,106.05 231.14,105.41 IC11.12 | 209.55,100.33 206.38,103.5 IC9.12 | 209.55,100.33 207.01,97.79 207.01,95.25 205.1,93.34 151.13,93.34 151.13,97.79 147.96,100.97 142.88,100.97 142.88,103.5 IC7.12
  Bottom 0.381: 58.42,129.54 58.42,106.68 59.69,105.41 IC3.12 60.33,103.5 61.59,102.23 66.04,102.23 66.04,125.73 74.3,133.99 116.84,133.99 | 58.42,129.54 59.69,130.81 IC4.12 | 33.02,106.05 34.29,106.05 34.29,105.41 IC1.12 | 33.02,106.05 31.11,106.05 30.48,105.41 30.48,86.36 26.67,82.55 IC17.2 | 33.02,106.05 33.02,129.54 34.29,130.81 IC2.12 34.29,133.35 34.29,133.99 42.55,133.99 43.18,133.35 43.18,129.54 58.42,129.54 | IC13.12 320.04,105.41 318.77,106.68 318.77,129.54 320.04,130.81 IC14.12 | IC15.12 344.81,104.78 344.17,105.41 344.17,129.54 345.44,130.81 IC16.12 | 140.97,129.54 140.97,106.68 142.24,105.41 IC7.12 | 140.97,129.54 142.24,130.81 IC8.12 | IC5.12 116.84,105.41 118.11,106.68 118.11,118.11 113.03,123.19 113.03,127 116.84,130.81 IC6.12 116.84,133.35 116.84,133.99 | 140.97,129.54 125.73,129.54 125.73,133.35 123.83,135.25 116.84,135.25 116.84,133.99 | IC9.12 205.74,105.41 204.47,106.68 204.47,120.65 201.93,123.19 201.93,126.36 205.74,130.18 205.74,130.81 IC10.12 | IC16.9 353.06,130.81 355.6,128.27 355.6,94.61 350.52,89.53 232.41,89.53 232.41,101.6 231.14,102.87 IC11.12
RUN
  Bottom 0.381: IC16.15 337.82,130.81 341.63,127 341.63,102.23 342.26,101.6 346.71,101.6 346.71,107.31 351.79,112.39 351.79,114.94 351.15,115.57 D40.33
SC0
  Top 0.381: IC1.4 31.75,97.79 30.48,99.06 30.48,109.86 33.02,112.39 33.02,113.67 34.29,114.94 C40.9
SC1
  Top 0.381: IC2.1 24.13,123.19 22.86,121.92 22.86,114.94 24.13,113.67 C40.2
SC2
  Bottom 0.381: IC2.6 37.47,125.09 38.73,126.36 43.81,126.36 43.81,125.09 52.07,116.84 52.07,116.2 C40.23
SC3
  Top 0.381: IC3.3 53.98,97.16 39.37,111.76 36.83,111.76 36.83,112.39 C40.12
SC4
  Top 0.381: IC4.15 52.7,131.44 56.52,127.64 60.96,127.64 60.96,120.02 64.77,116.2 C40.33
SCK
  Top 0.381: 35.56,79.38 31.11,79.38 29.84,80.64 IC17.3 | 35.56,79.38 35.56,101.6 36.83,102.87 IC1.11 | IC2.11 36.83,130.81 39.37,128.27 48.26,128.27 48.26,121.28 53.34,116.2 53.34,112.39 59.69,106.05 62.23,106.05 62.23,105.41 IC3.11 62.87,103.5 68.58,97.79 68.58,79.38 35.56,79.38 | 227.33,93.34 234.31,93.34 234.31,94.61 234.95,95.25 234.95,100.33 233.68,101.6 233.68,102.87 IC11.11 | 227.33,93.34 217.81,93.34 216.53,94.61 216.53,97.16 214.63,99.06 214.63,99.69 212.72,99.69 208.91,103.5 IC9.11 | 227.33,93.34 227.33,97.79 222.25,102.87 222.25,105.41 217.17,110.49 217.17,128.27 212.09,128.27 208.91,131.44 IC10.11 | IC7.11 145.41,103.5 146.69,102.23 151.13,102.23 151.13,125.73 145.41,131.44 IC8.11
  Bottom 0.381: IC3.11 62.23,105.41 60.96,106.68 60.96,129.54 62.23,130.81 IC4.11 62.87,132.72 66.67,136.53 144.78,136.53 | 323.85,101.6 322.58,102.87 IC13.11 | 323.85,101.6 323.85,95.25 323.21,94.61 316.23,94.61 316.23,106.05 | 316.23,106.05 316.23,128.27 318.77,130.81 318.77,133.35 319.4,133.99 322.58,133.99 322.58,133.35 IC14.11 | 349.25,100.33 349.25,94.61 349.88,93.98 353.69,93.98 354.33,94.61 354.33,125.73 348.62,131.44 IC16.11 | 349.25,100.33 349.25,102.23 348.62,102.87 IC15.11 | 323.85,101.6 328.93,101.6 328.93,113.67 329.56,114.3 335.92,114.3 336.55,113.67 336.55,107.95 339.09,105.41 339.09,102.23 341,100.33 349.25,100.33 | IC12.11 233.68,130.81 232.41,129.54 232.41,106.68 233.68,105.41 IC11.11 233.68,102.87 233.68,99.06 234.95,97.79 234.95,94.61 239.4,94.61 241.94,97.16 241.94,106.05 316.23,106.05 | 123.19,114.3 123.19,118.11 118.11,123.19 118.11,125.73 123.19,130.81 123.19,133.35 122.56,133.99 119.38,133.99 119.38,133.35 IC6.11 | 123.19,114.3 123.19,102.23 121.28,102.23 120.02,103.5 IC5.11 | 123.19,114.3 130.81,114.3 130.81,110.49 135.89,105.41 135.89,102.87 140.97,97.79 140.97,95.25 141.6,94.61 146.05,94.61 146.05,101.6 144.78,102.87 IC7.11 | 144.78,136.53 205.1,136.53 208.28,133.35 IC10.11 | 144.78,136.53 144.78,133.35 IC8.11
SCL
  Top 0.381: 125.09,99.69 121.92,102.87 IC5.10 | 125.09,99.69 126.36,98.42 126.36,93.34 139.06,93.34 140.97,95.25 140.97,97.79 138.43,100.33 138.43,106.05 145.41,106.05 146.69,104.78 IC7.10 | IC17.6 36.83,82.55 38.1,83.82 38.1,101.6 39.37,102.87 IC1.10 | IC4.10 64.14,132.72 61.59,135.25 50.8,135.25 50.8,130.81 50.16,130.18 39.37,130.18 39.37,130.81 IC2.10 | 125.09,99.69 123.19,97.79 123.19,95.25 121.28,93.34 69.85,93.34 69.85,97.79 64.77,102.87 IC3.10 | IC15.10 351.15,104.78 351.79,105.41 351.79,129.54 350.52,130.81 IC16.10
  Bottom 0.381: IC8.10 147.32,130.81 148.59,129.54 148.59,106.68 147.32,105.41 IC7.10 147.32,102.87 148.59,101.6 148.59,95.25 149.22,94.61 174.62,94.61 174.62,122.56 179.07,127 201.29,127 201.29,127.64 204.47,130.81 204.47,133.35 205.1,133.99 206.38,133.99 207.01,133.35 207.01,128.91 | IC5.10 121.92,105.41 120.65,106.68 120.65,118.11 115.57,123.19 115.57,125.73 121.28,131.44 IC6.10 | IC3.10 64.77,105.41 63.5,106.68 63.5,129.54 64.77,130.81 IC4.10 | IC2.10 39.37,130.81 35.56,127 35.56,109.22 39.37,105.41 IC1.10 | IC13.10 325.12,105.41 321.31,109.22 321.31,127 325.12,130.81 IC14.10 325.12,133.35 325.12,135.25 | 325.12,135.25 347.35,135.25 349.88,132.72 IC16.10 | 236.85,130.18 236.22,130.81 IC12.10 235.59,132.72 234.31,133.99 222.25,133.99 222.25,130.81 221.62,130.18 214.63,130.18 214.63,133.35 214,133.99 210.82,133.99 210.82,133.35 IC10.10 210.19,131.44 210.19,130.18 208.28,130.18 207.01,128.91 | 236.85,130.18 237.49,129.54 237.49,106.68 236.22,105.41 IC11.10 | 207.01,128.91 204.47,126.36 204.47,123.19 207.01,120.65 207.01,109.22 210.82,105.41 IC9.10 | 325.12,135.25 311.15,135.25 311.15,130.81 310.51,130.18 236.85,130.18
TAD
  Top 0.381: IC14.15 312.42,130.81 311.15,129.54 311.15,114.94 312.42,113.67 D40.4
VCC
  Top 0.762: IC5.16 106.68,105.41 104.14,107.95 104.14,128.27 106.68,130.81 IC6.16 106.68,133.35 106.68,135.25 128.91,135.25 131.44,132.72 IC8.16 132.72,132.72 136.53,136.53 195.58,136.53 195.58,135.25 | IC2.16 24.77,132.72 26.67,134.62 49.53,134.62 49.53,133.35 IC4.16 | IC17.1 24.13,82.55 24.13,87.63 IC17.14 | IC17.4 31.11,81.92 24.77,88.27 IC17.14 | IC1.16 24.13,102.87 22.23,100.97 22.23,92.08 24.13,90.17 IC17.14 | IC13.16 309.88,105.41 307.34,107.95 307.34,128.27 309.88,130.81 IC14.16 309.88,133.35 309.88,134.62 327.66,134.62 329.56,132.72 334.64,132.72 IC16.16 | IC9.16 195.58,105.41 193.04,107.95 193.04,128.27 195.58,130.81 IC10.16 195.58,133.35 195.58,135.25 | 195.58,135.25 212.72,135.25 215.26,132.72 220.34,132.72 IC12.16
  Bottom 0.762: 104.78,93.34 123.83,93.34 126.36,95.89 126.36,97.16 132.08,102.87 IC7.16 | 104.78,93.34 104.78,100.97 106.68,102.87 IC5.16 | 43.81,93.34 43.81,90.81 36.83,83.82 31.75,83.82 31.75,82.55 IC17.4 | 43.81,93.34 43.81,97.16 49.53,102.87 IC3.16 | IC2.16 24.13,130.81 22.23,128.91 22.23,107.31 24.13,105.41 IC1.16 | 104.78,93.34 43.81,93.34 | IC15.16 334.64,102.87 329.56,97.79 329.56,95.89 327.02,93.34 307.98,93.34 307.98,100.97 309.88,102.87 IC13.16 | IC11.16 220.98,102.87 215.26,97.16 215.26,95.89 212.72,93.34 194.94,93.34 194.94,94.61 193.68,95.89 193.68,100.97 195.58,102.87 IC9.16 | IC14.16 309.25,132.72 295.27,132.72 295.27,134.62 294.64,135.25 220.98,135.25 220.98,133.35 IC12.16
WC
  Top 0.381: IC16.3 340.36,123.19 339.09,121.92 339.09,111.76 340.36,110.49 345.44,110.49 345.44,112.39 D40.30

### Text on the board
Bottom: PDP-8/I Light Board 50045108 | 5404519